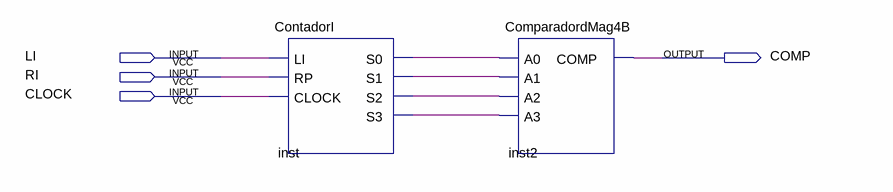
[diagram p0: schematic sheet]
// Quartus schematic ContadorIComp.bdf as structural Verilog: 2 symbols, 4 pins
module ContadorIComp (
  input  LI,
  input  RI,
  input  CLOCK,
  output COMP
);

  wire inst_s0, inst_s1, inst_s2, inst_s3;

  ContadorI inst (.LI(LI), .RP(RI), .CLOCK(CLOCK), .S0(inst_s0), .S1(inst_s1), .S2(inst_s2), .S3(inst_s3));
  ComparadordMag4B inst2 (.A0(inst_s0), .A1(inst_s1), .A2(inst_s2), .A3(inst_s3), .COMP(COMP));
endmodule
